# EAGLE schematic SpectroSlave (EAGLE 7.1.0)
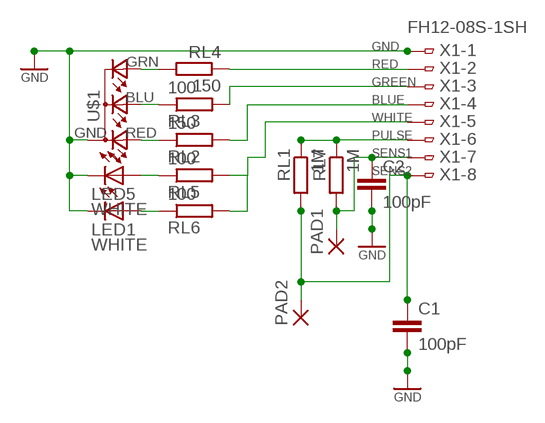
[diagram p0: schematic, sheet 1]

## Parts
C1  100pF  C-EUC0805  [C0805]
C2  100pF  C-EUC0805  [C0805]
LED1  WHITE  LEDCHIP-LED0805  [CHIP-LED0805]
LED5  WHITE  LEDCHIP-LED0805  [CHIP-LED0805]
PAD1  SMD5  [SMD2,54-5,08]
PAD2  SMD5  [SMD2,54-5,08]
RL1  1M  R-EU_R0805  [R0805]
RL2  150  R-EU_R0805  [R0805]
RL3  100  R-EU_R0805  [R0805]
RL4  150  R-EU_R0805  [R0805]
RL5  100  R-EU_R0805  [R0805]
RL6  100  R-EU_R0805  [R0805]
RL7  1M  R-EU_R0805  [R0805]
U$1  RGB-COMMON-CATHODE  [LED-TRICOLOR-THROUGHHOLE]
X1  FH12-08S-1SH  [FH12-08S-1SH]

## Nets
BLUE: RL2.2 X1.4
GND [power]: C1.2 C2.2 LED1.C LED5.C U$1.GND(A2) X1.1
GREEN: RL3.2 X1.3
N$1: RL4.2 U$1.GRN(CGREEN)
N$2: RL3.1 U$1.BLU(CBLUE)
N$3: RL2.1 U$1.RED(CRED)
N$4: LED5.A RL5.1
N$5: LED1.A RL6.1
PULSE: RL1.1 RL7.1 X1.6
RED: RL4.1 X1.2
SENS1: C2.1 PAD1.1(P) RL7.2 X1.7
SENS2: C1.1 PAD2.1(P) RL1.2 X1.8
WHITE: RL5.2 RL6.2 X1.5

## Library data of the parts
C1 C2 = rcl:C-EU: CAPACITOR, European symbol
LED1 LED5 = led:LED: LED OSRAM: - CHIPLED LG R971, LG N971, LY N971, LG Q971, LY Q971, LO R971, LY R971 LH N974, LH R974 LS Q976, LO Q976, LY Q976 LO Q996 - Hyper CHIPLED LW Q18S LB Q993, LB Q99A, LB R99A - SideLED LS A670, LO A670, LY A670, LG A670, LP A670 LB A673, LV A673, LT A673, LW A673 LH A674 LY A675 LS A676, LA A676, LO A676, LY A676, LW A676 LS A679, LY A679, LG A679 - Hyper Micro SIDELED® LS Y876, LA Y876, LO Y876, LY Y876 LT Y87S - SmartLED LW L88C, LW L88S LB L89C, LB L89S, LG L890 LS L89K, LO L89K, LY L89K LS L896, LA L896, LO L896, LY L896 - TOPLED LS T670, LO T670, LY T670, LG T670, LP T670 LSG T670, LSP T670, LSY T670, LOP T670, LYG T670 LG T671, LOG T671, LSG T671 LB T673, LV T673, LT T673, LW T673 LH T674 LS T676, LA T676, LO T676, LY T676, LB T676, LH T676, LSB T676, LW T676 LB T67C, LV T67C, LT T67C, LS T67K, LO T67K, LY T67K, LW E67C LS E67B, LA E67B, LO E67B, LY E67B, LB E67C, LV E67C, LT E67C LW T67C LS T679, LY T679, LG T679 LS T770, LO T770, LY T770, LG T770, LP T770 LB T773, LV T773, LT T773, LW T773 LH T774 LS E675, LA E675, LY E675, LS T675 LS T776, LA T776, LO T776, LY T776, LB T776 LHGB T686 LT T68C, LB T68C - Hyper Mini TOPLED® LB M676 - Mini TOPLED Santana® LG M470 LS M47K, LO M47K, LY M47K Source: http://www.osram.convergy.de LUXEON: - LUMILED® LXK2-PW12-R00, LXK2-PW12-S00, LXK2-PW14-U00, LXK2-PW14-V00 LXK2-PM12-R00, LXK2-PM12-S00, LXK2-PM14-U00 LXK2-PE12-Q00, LXK2-PE12-R00, LXK2-PE12-S00, LXK2-PE14-T00, LXK2-PE14-U00 LXK2-PB12-K00, LXK2-PB12-L00, LXK2-PB12-M00, LXK2-PB14-N00, LXK2-PB14-P00, LXK2-PB14-Q00 LXK2-PR12-L00, LXK2-PR12-M00, LXK2-PR14-Q00, LXK2-PR14-R00 LXK2-PD12-Q00, LXK2-PD12-R00, LXK2-PD12-S00 LXK2-PH12-R00, LXK2-PH12-S00 LXK2-PL12-P00, LXK2-PL12-Q00, LXK2-PL12-R00 Source: www.luxeon.com KINGBRIGHT: KA-3528ASYC Source: www.kingbright.com
PAD1 PAD2 = wirepad:SMD5: SMD PAD
RL1-RL7 = rcl:R-EU_: RESISTOR, European symbol
U$1 = lpatiny:RGB-COMMON-CATHODE
X1 = con-hirose:FH12-08S-1S: 1mm Pitch Connectors For FPC/FFC Source: Data sheet <http://www.hirose.co.jp/cataloge_hp/e58605370.pdf>; OC_FARNELL: unknown; OC_NEWARK: unknown

## Net classes
0 default: width 0.457 mm
1 power: width 0.457 mm
2 VIN: width 0.457 mm
3 fine: width 0.457 mm
4 aref: width 0.457 mm